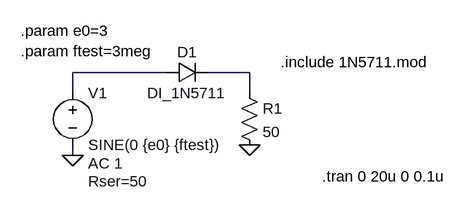
[diagram p0: schematic Draft1.asc]
Draft1.asc, the LTspice schematic file:
Version 4
SHEET 1 880 680
WIRE 192 80 48 80
WIRE 320 80 256 80
WIRE 48 112 48 80
WIRE 320 112 320 80
WIRE 48 208 48 192
FLAG 48 208 0
FLAG 320 192 0
SYMBOL voltage 48 96 R0
WINDOW 123 24 124 Left 2
WINDOW 39 24 152 Left 2
SYMATTR InstName V1
SYMATTR Value SINE(0 {e0} {ftest})
SYMATTR Value2 AC 1
SYMATTR SpiceLine Rser=50
SYMBOL diode 192 96 R270
WINDOW 0 32 32 VTop 2
WINDOW 3 0 32 VBottom 2
SYMATTR InstName D1
SYMATTR Value DI_1N5711
SYMBOL res 304 96 R0
SYMATTR InstName R1
SYMATTR Value 50
TEXT 368 64 Left 2 !.include 1N5711.mod
TEXT 432 240 Left 2 !.tran 0 20u 0 0.1u
TEXT -32 16 Left 2 !.param e0=3\n.param ftest=3meg

The netlist it stands for:
* Draft1.asc
V1 N001 0 SINE(0 {e0} {ftest}) AC 1 Rser=50
D1 N001 N002 DI_1N5711
R1 N002 0 50
.model D D
.lib standard.dio
.include 1N5711.mod
.tran 0 20u 0 0.1u
.param e0=3
.param ftest=3meg
.backanno
.end